# Altium project etna.PrjPCB
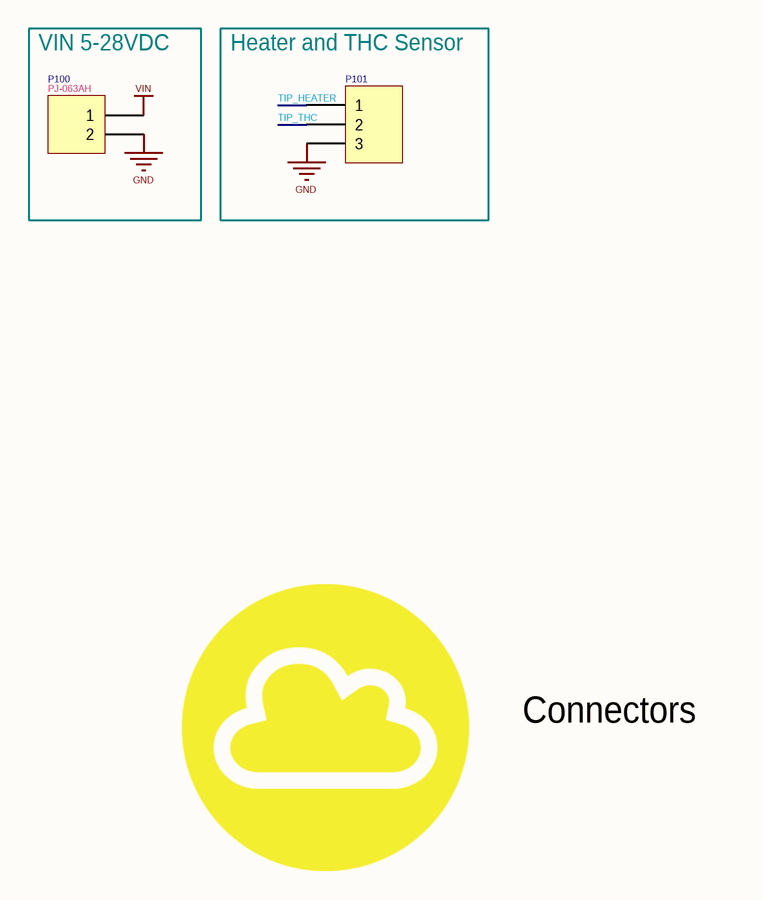
[diagram p0: etna-sch-connectors.SchDoc]
project_client: Illysky; project_name: Etna; project_output: etna-hw; project_rev: v1.0.0
6 sheets, 87 parts. Net scope: global (net labels, ports and power ports of the same name join across sheets).
Board file: etna-pcb-main.PcbDoc
Sheets:
  etna-sch-connectors.SchDoc
  etna-sch-pmic.SchDoc
  etna-sch-mcu.SchDoc
  etna-sch-driver.SchDoc
  etna-sch-sensor.SchDoc
  etna-sch-ui.SchDoc

## Sheet etna-sch-connectors.SchDoc
size A4; SheetNumber: 1; SheetTotal: 6; PageSetup: Record=PageOptions|CenterHorizontal=True|CenterVertical=True|PrintScale=0.73|XCorrection=1.00|YCorrection=1.00|PrintKind=1|BorderSize=5000000|LeftOffset=0|BottomOffset=0|Orientation=2|PaperLength=1000|PaperWidth=1000|Scale=100|PaperSource=15|PrintQuality=1200|MediaType=1|DitherType=10|PaperKind=A4|PrintScaleMode=1

### Parts
P100  PJ-063AH  [PJ-063AH]
P101  (no value)  [3x3x3]

### Blocks framed on the sheet
VIN 5-28VDC: P100
Heater and THC Sensor: P101

### Nets
GND: P100.2 P101.3
VIN: P100.1
TIP_HEATER: P101.1
TIP_THC: P101.2

### Notes on the sheet
- Connectors

### Library data of the parts
P100 = Header 2: Header, 2-Pin; LatestRevisionDate: 17-Jul-2002; LatestRevisionNote: Re-released for DXP Platform.; Publisher: Altium Limited
P101 = Header 3: Header, 3-Pin; LatestRevisionDate: 17-Jul-2002; LatestRevisionNote: Re-released for DXP Platform.; Publisher: Altium Limited

## Sheet etna-sch-pmic.SchDoc
size A4; SheetNumber: 2; SheetTotal: 6; PageSetup: Record=PageOptions|CenterHorizontal=True|CenterVertical=True|PrintScale=0.73|XCorrection=1.00|YCorrection=1.00|PrintKind=1|BorderSize=5000000|LeftOffset=0|BottomOffset=0|Orientation=2|PaperLength=1000|PaperWidth=1000|Scale=100|PaperSource=15|PrintQuality=1200|MediaType=1|DitherType=10|PaperKind=A4|PrintScaleMode=1
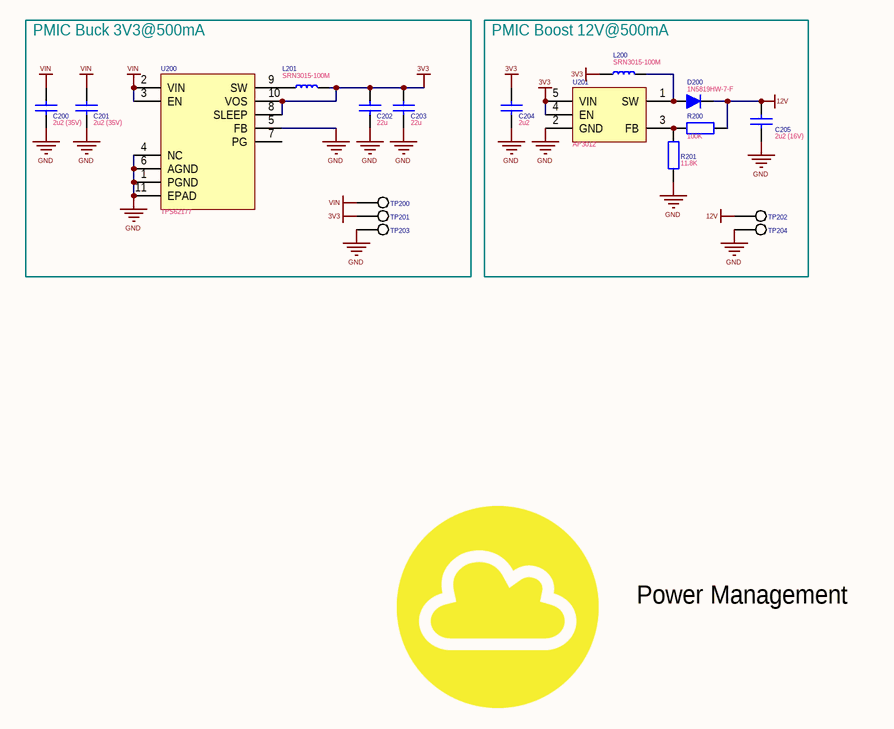
[diagram p1: etna-sch-pmic.SchDoc]

### Parts
C200  2u2 (35V)  [0805-CAP]
C201  2u2 (35V)  [0805-CAP]
C202  22u  [0805-CAP]
C203  22u  [0805-CAP]
C204  2u2  [0603-capacitor]
C205  2u2 (16V)  [0603-capacitor]
D200  1N5819HW-7-F  [SOD123-DIODE]
L200  SRN3015-100M  [SRN3015]
L201  SRN3015-100M  [SRN3015]
R200  100K  [0402-resistor]
R201  11.8K  [0402-resistor]
TP200  TP  [TESTPOINT]  (value not drawn)
TP201  TP  [TESTPOINT]  (value not drawn)
TP202  TP  [TESTPOINT]  (value not drawn)
TP203  TP  [TESTPOINT]  (value not drawn)
TP204  TP  [TESTPOINT]  (value not drawn)
U200  TPS62177  [WSON10]
U201  AP3012  [SOT-235]

### Blocks framed on the sheet
PMIC Buck 3V3@500mA: C200-C203 L201 TP200 TP201 TP203 U200
PMIC Boost 12V@500mA: C204 C205 D200 L200 R200 R201 TP202 TP204 U201

### Nets
3V3: C202.2 C203.2 C204.2 L200.1 L201.2 TP201.1(GND) U200.8(SLEEP) U200.10(VOS) U201.4(EN) U201.5(VIN)
12V: C205.2 D200.2(K) R200.2 TP202.1(GND)
GND: C200.1 C201.1 C202.1 C203.1 C204.1 C205.1 R201.2 TP203.1(GND) TP204.1(GND) U200.1(PGND) U200.4(NC) U200.5(FB) U200.6(AGND) U200.11(EPAD) U201.2(GND)
VIN: C200.2 C201.2 TP200.1(GND) U200.2(VIN) U200.3(EN)
NetD200_1: D200.1(A) L200.2 U201.1(SW)
NetL201_1: L201.1 U200.9(SW)
NetR200_1: R200.1 R201.1 U201.3(FB)

Not connected (* = marked no-connect by the designer): U200 7(PG)

### Notes on the sheet
- Power Management

### Library data of the parts
C200-C205 = CAP: Capacitor
D200 = DIODE: Published: 8-Jun-2000; LatestRevisionDate: 17-Jul-2002; LatestRevisionNote: Re-released for DXP Platform.; PackageVersion: Sep-1996; PackageReference: SMC; Publisher: Altium Limited; PackageDescription: DO-214-AB/SMC; 2 C-Bend Leads; Body 7.9 x 5.9 mm, inc. leads (LxW); Code_JEDEC: DO-214-AB
L200 L201 = IND: Inductor or Ferrite
R200 R201 = RES: Resistor
TP200-TP204 = TEST_POINT
U200 = TPS62175: TPS6217x 28-V, 0.5-A Step-Down Converter With Sleep Mode
U201 = AP3012: 1.5MHz STEP-UP DC-DC CONVERTER

## Sheet etna-sch-mcu.SchDoc
size A4; SheetNumber: 3; SheetTotal: 6; PageSetup: Record=PageOptions|CenterHorizontal=True|CenterVertical=True|PrintScale=0.73|XCorrection=1.00|YCorrection=1.00|PrintKind=1|BorderSize=5000000|LeftOffset=0|BottomOffset=0|Orientation=2|PaperLength=1000|PaperWidth=1000|Scale=100|PaperSource=15|PrintQuality=1200|MediaType=1|DitherType=10|PaperKind=A4|PrintScaleMode=1
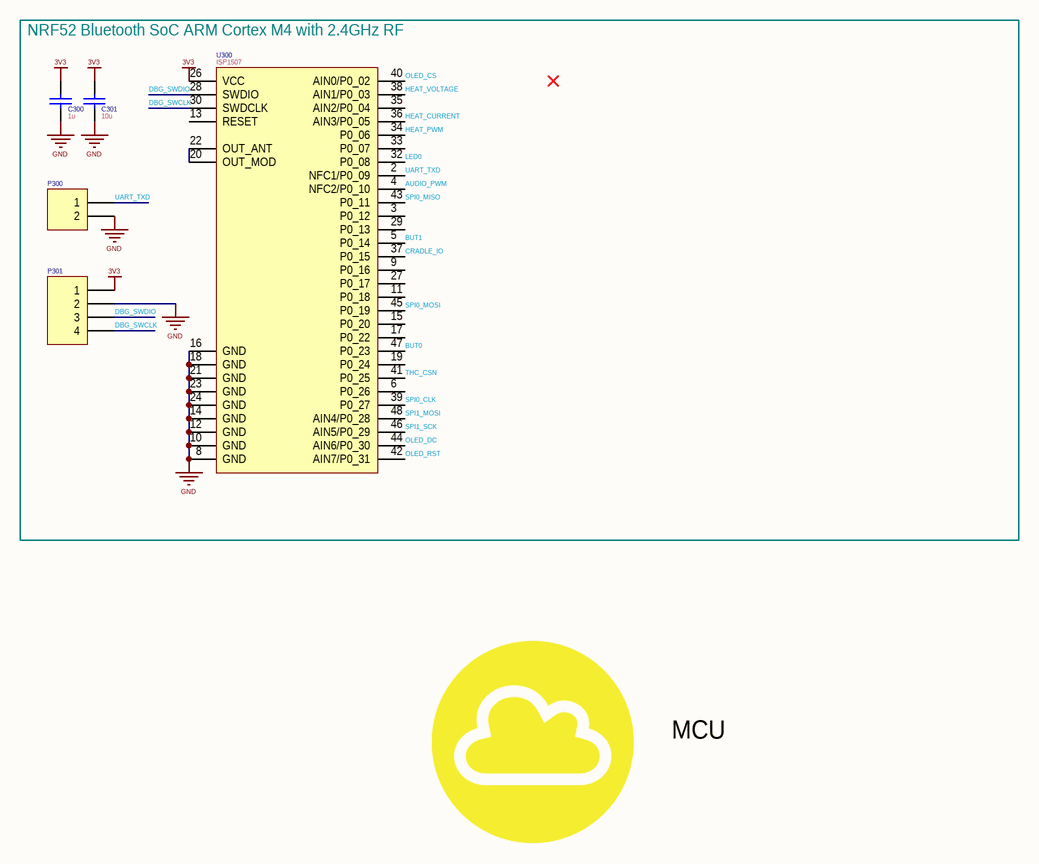
[diagram p2: etna-sch-mcu.SchDoc]

### Parts
C300  1u  [0402-capacitor]
C301  10u  [0603-capacitor]
P300  (no value)  [HDR1X2]
P301  (no value)  [HDR1X4]
U300  ISP1507  [ISP1507]

### Blocks framed on the sheet
NRF52 Bluetooth SoC ARM Cortex M4 with 2.4GHz RF: C300 C301 P300 P301 U300

### Nets
3V3: C300.2 C301.2 P301.1 U300.26(VCC)
GND: C300.1 C301.1 P300.2 P301.2 U300.8(GND) U300.10(GND) U300.12(GND) U300.14(GND) U300.16(GND) U300.18(GND) U300.21(GND) U300.23(GND) U300.24(GND)
AUDIO_PWM: U300.4(NFC2/P0_10)
BUT0: U300.47(P0_23)
BUT1: U300.5(P0_14)
CRADLE_IO: U300.37(P0_15)
DBG_SWCLK: P301.4 U300.30(SWDCLK)
DBG_SWDIO: P301.3 U300.28(SWDIO)
HEAT_CURRENT: U300.36(AIN3/P0_05)
HEAT_PWM: U300.34(P0_06)
HEAT_VOLTAGE: U300.38(AIN1/P0_03)
LED0: U300.32(P0_08)
OLED_CS: U300.40(AIN0/P0_02)
OLED_DC: U300.44(AIN6/P0_30)
OLED_RST: U300.42(AIN7/P0_31)
SPI0_CLK: U300.39(P0_27)
SPI0_MISO: U300.43(P0_11)
SPI0_MOSI: U300.45(P0_19)
SPI1_MOSI: U300.48(AIN4/P0_28)
SPI1_SCK: U300.46(AIN5/P0_29)
THC_CSN: U300.41(P0_25)
UART_TXD: P300.1 U300.2(NFC1/P0_09)
NetU300_20: U300.20(OUT_MOD) U300.22(OUT_ANT)

Not connected (* = marked no-connect by the designer): U300 1(NC) 3(P0_12) 6(P0_26) 7(NC) 9(P0_16) 11(P0_18) 13(RESET) 15(P0_20) 17(P0_22) 19(P0_24) 25(NC) 27(P0_17) 29(P0_13) 31(NC) 33(P0_07) 35(AIN2/P0_04) 49(NC) 50(NC) 51(NC) 52(NC) 53(NC) 54(NC) 55(NC) 56(NC) 57(NC) 58(NC) 59(NC) 60(NC) 61(NC) 62(NC)

### Notes on the sheet
- MCU

### Library data of the parts
C300 C301 = CAP: Capacitor
P300 = Header 2: Header, 2-Pin; LatestRevisionDate: 17-Jul-2002; LatestRevisionNote: Re-released for DXP Platform.; Publisher: Altium Limited
P301 = Header 4: Header, 4-Pin; LatestRevisionDate: 17-Jul-2002; LatestRevisionNote: Re-released for DXP Platform.; Publisher: Altium Limited
U300 = ISP1507: High Performance Bluetooth+ANT+NFC Low Energy Module with MCU and Antenna

## Sheet etna-sch-driver.SchDoc
size A4; SheetNumber: 4; SheetTotal: 6; PageSetup: Record=PageOptions|CenterHorizontal=True|CenterVertical=True|PrintScale=0.73|XCorrection=1.00|YCorrection=1.00|PrintKind=1|BorderSize=5000000|LeftOffset=0|BottomOffset=0|Orientation=2|PaperLength=1000|PaperWidth=1000|Scale=100|PaperSource=15|PrintQuality=1200|MediaType=1|DitherType=10|PaperKind=A4|PrintScaleMode=1
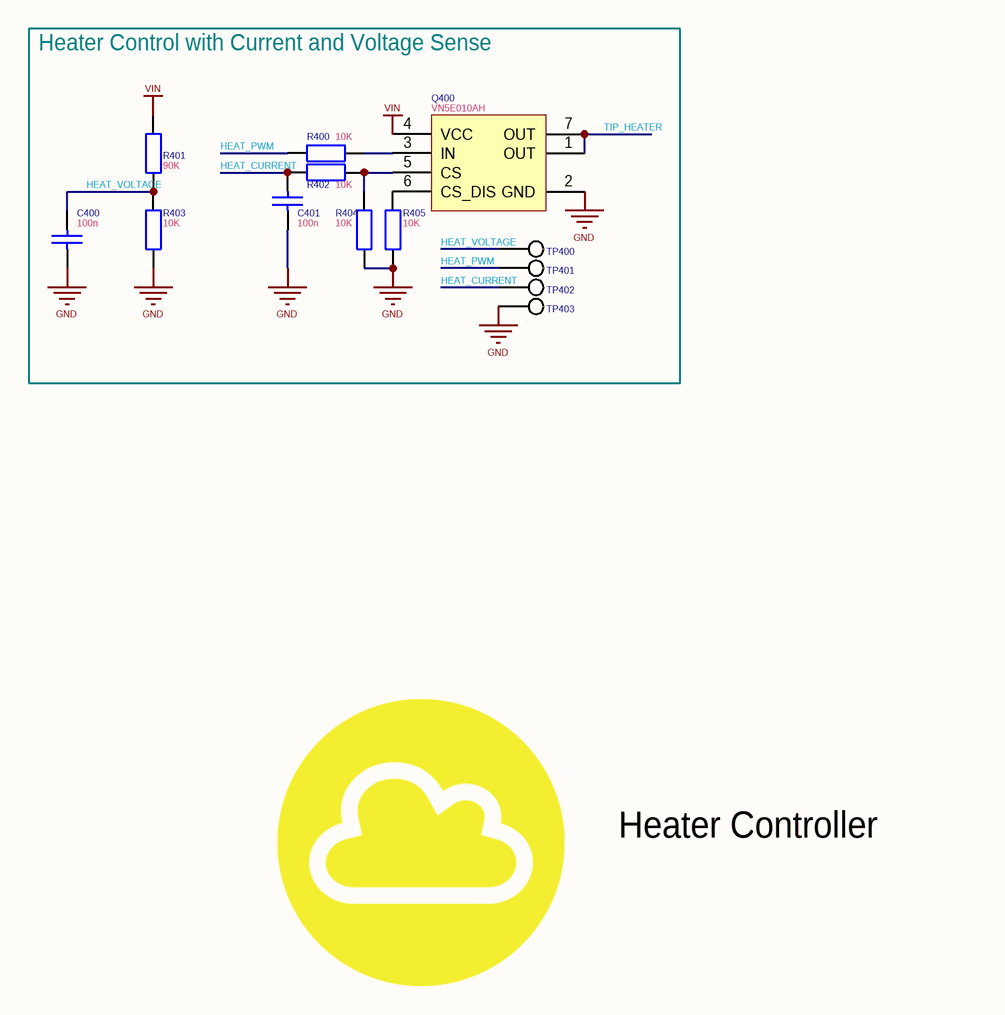
[diagram p3: etna-sch-driver.SchDoc]

### Parts
C400  100n  [0402-capacitor]
C401  100n  [0402-capacitor]
Q400  VN5E010AH  [HPAK6]
R400  10K  [0402-resistor]
R401  90K  [0402-resistor]
R402  10K  [0402-resistor]
R403  10K  [0402-resistor]
R404  10K  [0402-resistor]
R405  10K  [0402-resistor]
TP400  TP  [TESTPOINT]  (value not drawn)
TP401  TP  [TESTPOINT]  (value not drawn)
TP402  TP  [TESTPOINT]  (value not drawn)
TP403  TP  [TESTPOINT]  (value not drawn)

### Blocks framed on the sheet
Heater Control with Current and Voltage Sense: C400 C401 Q400 R400-R405 TP400-TP403

### Nets
GND: C400.1 C401.1 Q400.2(GND) R403.2 R404.2 R405.2 TP403.1(GND)
VIN: Q400.4(VCC) R401.1
HEAT_CURRENT: C401.2 R402.2 TP402.1(GND)
HEAT_PWM: R400.2 TP401.1(GND)
HEAT_VOLTAGE: C400.2 R401.2 R403.1 TP400.1(GND)
TIP_HEATER: Q400.1(OUT) Q400.7(OUT)
NetQ400_3: Q400.3(IN) R400.1
NetQ400_5: Q400.5(CS) R402.1 R404.1
NetQ400_6: Q400.6(CS_DIS) R405.1

### Notes on the sheet
- Heater Controller

### Library data of the parts
C400 C401 = CAP: Capacitor
Q400 = VN5E010AH: 10 m high-side driver with analog current sense  for automotive applications
R400-R405 = RES: Resistor
TP400-TP403 = TEST_POINT

## Sheet etna-sch-sensor.SchDoc
size A4; SheetNumber: 5; SheetTotal: 6; PageSetup: Record=PageOptions|CenterHorizontal=True|CenterVertical=True|PrintScale=0.73|XCorrection=1.00|YCorrection=1.00|PrintKind=1|BorderSize=5000000|LeftOffset=0|BottomOffset=0|Orientation=2|PaperLength=1000|PaperWidth=1000|Scale=100|PaperSource=15|PrintQuality=1200|MediaType=1|DitherType=10|PaperKind=A4|PrintScaleMode=1
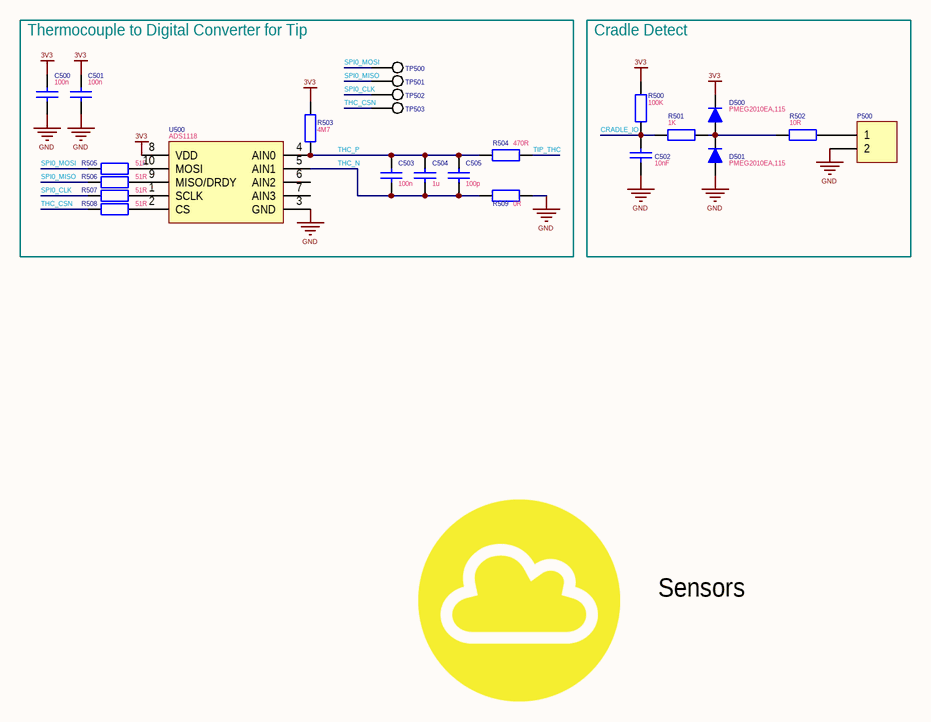
[diagram p4: etna-sch-sensor.SchDoc]

### Parts
C500  100n  [0402-capacitor]
C501  100n  [0402-capacitor]
C502  10nF  [0402-capacitor]
C503  100n  [0402-capacitor]
C504  1u  [0402-capacitor]
C505  100p  [0402-capacitor]
D500  PMEG2010EA,115  [SOD-323]
D501  PMEG2010EA,115  [SOD-323]
P500  (no value)  [HDR1X2]
R500  100K  [0402-resistor]
R501  1K  [0402-resistor]
R502  10R  [0402-resistor]
R503  4M7  [0402-resistor]
R504  470R  [0402-resistor]
R505  51R  [0402-resistor]
R506  51R  [0402-resistor]
R507  51R  [0402-resistor]
R508  51R  [0402-resistor]
R509  0R  [0402-resistor]
TP500  TP  [TESTPOINT]  (value not drawn)
TP501  TP  [TESTPOINT]  (value not drawn)
TP502  TP  [TESTPOINT]  (value not drawn)
TP503  TP  [TESTPOINT]  (value not drawn)
U500  ADS1118  [VSSOP-10]

### Blocks framed on the sheet
Thermocouple to Digital Converter for Tip: C500 C501 C503-C505 R503-R509 TP500-TP503 U500
Cradle Detect: C502 D500 D501 P500 R500-R502

### Nets
3V3: C500.2 C501.2 D500.2(K) R500.1 R503.1 U500.8(VDD)
GND: C500.1 C501.1 C502.1 D501.1(A) P500.2 R509.1 U500.3(GND)
CRADLE_IO: C502.2 R500.2 R501.1
SPI0_CLK: R507.2 TP502.1(GND)
SPI0_MISO: R506.2 TP501.1(GND)
SPI0_MOSI: R505.2 TP500.1(GND)
THC_CSN: R508.2 TP503.1(GND)
THC_N: C503.1 C504.1 C505.1 R509.2 U500.5(AIN1)
THC_P: C503.2 C504.2 C505.2 R503.2 R504.2 U500.4(AIN0)
TIP_THC: R504.1
NetD500_1: D500.1(A) D501.2(K) R501.2 R502.1
NetP500_1: P500.1 R502.2
NetR505_1: R505.1 U500.10(MOSI)
NetR506_1: R506.1 U500.9(MISO/DRDY)
NetR507_1: R507.1 U500.1(SCLK)
NetR508_1: R508.1 U500.2(CS)

Not connected (* = marked no-connect by the designer): U500 6(AIN2) 7(AIN3)

### Notes on the sheet
- Sensors

### Library data of the parts
C500-C505 = CAP: Capacitor
D500 D501 = DIODE: Published: 8-Jun-2000; LatestRevisionDate: 17-Jul-2002; LatestRevisionNote: Re-released for DXP Platform.; PackageVersion: Sep-1996; PackageReference: SMC; Publisher: Altium Limited; PackageDescription: DO-214-AB/SMC; 2 C-Bend Leads; Body 7.9 x 5.9 mm, inc. leads (LxW); Code_JEDEC: DO-214-AB
P500 = Header 2: Header, 2-Pin; LatestRevisionDate: 17-Jul-2002; LatestRevisionNote: Re-released for DXP Platform.; Publisher: Altium Limited
R500-R509 = RES: Resistor
TP500-TP503 = TEST_POINT
U500 = ADS1118: ADS1118 Ultrasmall, Low-Power, SPI™-Compatible, 16-Bit  Analog-to-Digital Converter with Internal Reference and Temperature Sensor

## Sheet etna-sch-ui.SchDoc
size A4; SheetNumber: 6; SheetTotal: 6; PageSetup: Record=PageOptions|CenterHorizontal=True|CenterVertical=True|PrintScale=0.73|XCorrection=1.00|YCorrection=1.00|PrintKind=1|BorderSize=5000000|LeftOffset=0|BottomOffset=0|Orientation=2|PaperLength=1000|PaperWidth=1000|Scale=100|PaperSource=15|PrintQuality=1200|MediaType=1|DitherType=10|PaperKind=A4|PrintScaleMode=1
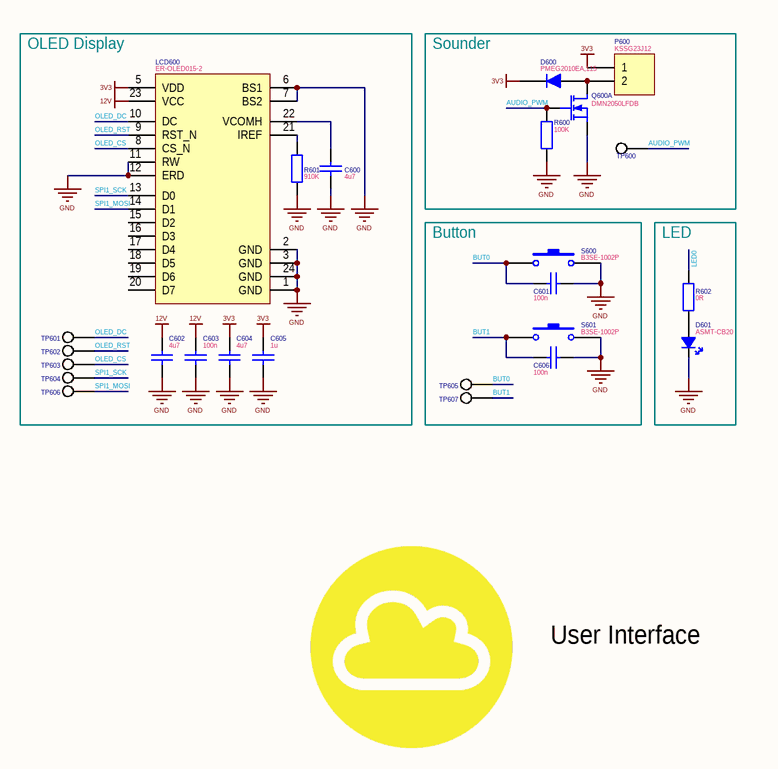
[diagram p5: etna-sch-ui.SchDoc]

### Parts
C600  4u7  [0603-capacitor]
C601  100n  [0402-capacitor]
C602  4u7  [0603-capacitor]
C603  100n  [0603-capacitor]
C604  4u7  [0603-capacitor]
C605  1u  [0603-capacitor]
C606  100n  [0402-capacitor]
D600  PMEG2010EA,115  [SOD-323]
D601  ASMT-CB20  [0603-LED]
LCD600  ER-OLED015-2  [XF2M-2415-1A-REV]
P600  KSSG23J12  [KSSG23J12]
Q600  DMN2050LFDB  [U-DFN2020-6]  (part A of 2)
R600  100K  [0402-resistor]
R601  910K  [0402-resistor]
R602  0R  [0402-resistor]
S600  B3SE-1002P  [B3SE-1002P]
S601  B3SE-1002P  [B3SE-1002P]
TP600  TP  [TESTPOINT]  (value not drawn)
TP601  TP  [TESTPOINT]  (value not drawn)
TP602  TP  [TESTPOINT]  (value not drawn)
TP603  TP  [TESTPOINT]  (value not drawn)
TP604  TP  [TESTPOINT]  (value not drawn)
TP605  TP  [TESTPOINT]  (value not drawn)
TP606  TP  [TESTPOINT]  (value not drawn)
TP607  TP  [TESTPOINT]  (value not drawn)

### Blocks framed on the sheet
OLED Display: C600 C602-C605 LCD600 R601 TP601-TP604 TP606
Sounder: D600 P600 Q600 R600 TP600
Button: C601 C606 S600 S601 TP605 TP607
LED: D601 R602

### Nets
3V3: C604.1 C605.1 D600.2(K) LCD600.5(VDD) P600.1
12V: C602.1 C603.1 LCD600.23(VCC)
GND: C600.2 C601.1 C602.2 C603.2 C604.2 C605.2 C606.1 D601.2(K) LCD600.1(GND) LCD600.2(GND) LCD600.3(GND) LCD600.6(BS1) LCD600.7(BS2) LCD600.11(RW) LCD600.12(ERD) LCD600.24(GND) Q600.S1 R600.1 R601.1 S600.1 S601.1
AUDIO_PWM: Q600.G1 R600.2 TP600.1(GND)
BUT0: C601.2 S600.2 TP605.1(GND)
BUT1: C606.2 S601.2 TP607.1(GND)
LED0: R602.2
OLED_CS: LCD600.8(CS_N) TP603.1(GND)
OLED_DC: LCD600.10(DC) TP601.1(GND)
OLED_RST: LCD600.9(RST_N) TP602.1(GND)
SPI1_MOSI: LCD600.14(D1) TP606.1(GND)
SPI1_SCK: LCD600.13(D0) TP604.1(GND)
NetC600_1: C600.1 LCD600.22(VCOMH)
NetD600_1: D600.1(A) P600.2 Q600.D1
NetD601_1: D601.1(A) R602.1
NetLCD600_21: LCD600.21(IREF) R601.2

Not connected (* = marked no-connect by the designer): LCD600 4(NC) 15(D2) 16(D3) 17(D4) 18(D5) 19(D6) 20(D7)

### Notes on the sheet
- User Interface

### Library data of the parts
C600-C606 = CAP: Capacitor
D600 = DIODE: Published: 8-Jun-2000; LatestRevisionDate: 17-Jul-2002; LatestRevisionNote: Re-released for DXP Platform.; PackageVersion: Sep-1996; PackageReference: SMC; Publisher: Altium Limited; PackageDescription: DO-214-AB/SMC; 2 C-Bend Leads; Body 7.9 x 5.9 mm, inc. leads (LxW); Code_JEDEC: DO-214-AB
D601 = LED: Published: 8-Jun-2000; LatestRevisionDate: 17-Jul-2002; LatestRevisionNote: Re-released for DXP Platform.; PackageVersion: Sep-1996; PackageReference: SMC; Publisher: Altium Limited; PackageDescription: DO-214-AB/SMC; 2 C-Bend Leads; Body 7.9 x 5.9 mm, inc. leads (LxW); Code_JEDEC: DO-214-AB
LCD600 = ER-OLED015-2: I2C 1.5"OLED Display Serial 128x64 Module,SSD1309,White on Black
P600 = Header 2: Header, 2-Pin; LatestRevisionDate: 17-Jul-2002; LatestRevisionNote: Re-released for DXP Platform.; Publisher: Altium Limited
Q600 = DMN2050LFDB: 20 V, 800 mA dual N-channel Trench MOSFET
R600-R602 = RES: Resistor
S600 S601 = SW-PB: Switch; Published: 24-Mar-1999; LatestRevisionDate: 17-Jul-2002; LatestRevisionNote: Re-released for DXP Platform.; PackageReference: SPST-2; Publisher: Altium Limited; PackageDescription: Switch; 2 Leads
TP600-TP607 = TEST_POINT

## Nets that join several sheets
3V3: etna-sch-pmic (10 pins), etna-sch-mcu (C300.2 C301.2 P301.1 U300.26), etna-sch-sensor (6 pins), etna-sch-ui (5 pins)
12V: etna-sch-pmic (C205.2 D200.2 R200.2 TP202.1), etna-sch-ui (C602.1 C603.1 LCD600.23)
GND: etna-sch-connectors (P100.2 P101.3), etna-sch-pmic (15 pins), etna-sch-mcu (13 pins), etna-sch-driver (7 pins), etna-sch-sensor (7 pins), etna-sch-ui (21 pins)
VIN: etna-sch-connectors (P100.1), etna-sch-pmic (5 pins), etna-sch-driver (Q400.4 R401.1)
AUDIO_PWM: etna-sch-mcu (U300.4), etna-sch-ui (Q600.G1 R600.2 TP600.1)
BUT0: etna-sch-mcu (U300.47), etna-sch-ui (C601.2 S600.2 TP605.1)
BUT1: etna-sch-mcu (U300.5), etna-sch-ui (C606.2 S601.2 TP607.1)
CRADLE_IO: etna-sch-mcu (U300.37), etna-sch-sensor (C502.2 R500.2 R501.1)
HEAT_CURRENT: etna-sch-mcu (U300.36), etna-sch-driver (C401.2 R402.2 TP402.1)
HEAT_PWM: etna-sch-mcu (U300.34), etna-sch-driver (R400.2 TP401.1)
HEAT_VOLTAGE: etna-sch-mcu (U300.38), etna-sch-driver (C400.2 R401.2 R403.1 TP400.1)
LED0: etna-sch-mcu (U300.32), etna-sch-ui (R602.2)
OLED_CS: etna-sch-mcu (U300.40), etna-sch-ui (LCD600.8 TP603.1)
OLED_DC: etna-sch-mcu (U300.44), etna-sch-ui (LCD600.10 TP601.1)
OLED_RST: etna-sch-mcu (U300.42), etna-sch-ui (LCD600.9 TP602.1)
SPI0_CLK: etna-sch-mcu (U300.39), etna-sch-sensor (R507.2 TP502.1)
SPI0_MISO: etna-sch-mcu (U300.43), etna-sch-sensor (R506.2 TP501.1)
SPI0_MOSI: etna-sch-mcu (U300.45), etna-sch-sensor (R505.2 TP500.1)
SPI1_MOSI: etna-sch-mcu (U300.48), etna-sch-ui (LCD600.14 TP606.1)
SPI1_SCK: etna-sch-mcu (U300.46), etna-sch-ui (LCD600.13 TP604.1)
THC_CSN: etna-sch-mcu (U300.41), etna-sch-sensor (R508.2 TP503.1)
TIP_HEATER: etna-sch-connectors (P101.1), etna-sch-driver (Q400.1 Q400.7)
TIP_THC: etna-sch-connectors (P101.2), etna-sch-sensor (R504.1)